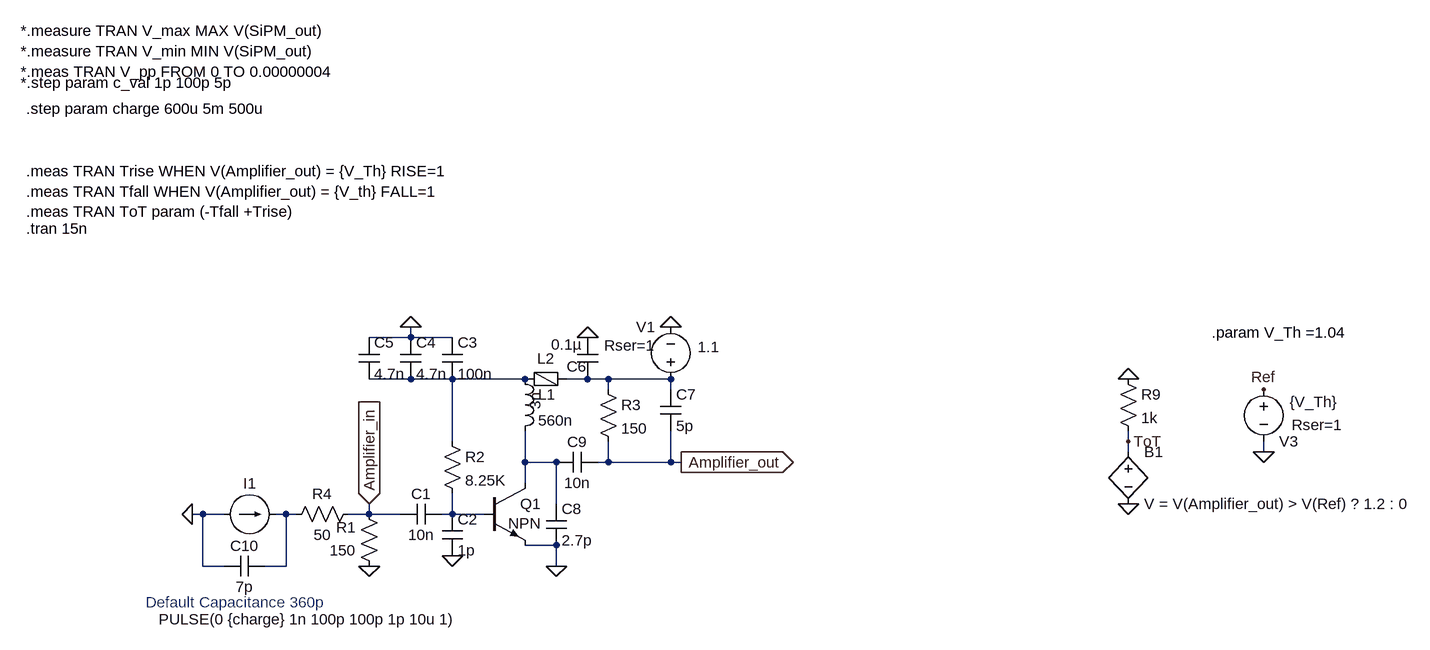
[diagram p0: schematic FARICH_TOT_Simulation_.asc]
FARICH_TOT_Simulation_.asc, the LTspice schematic file:
Version 4
SHEET 1 1708 896
WIRE 128 -112 128 -128
WIRE 128 -112 64 -112
WIRE 192 -112 128 -112
WIRE 128 -48 64 -48
WIRE 192 -48 128 -48
WIRE 304 -48 192 -48
WIRE 400 -48 368 -48
WIRE 432 -48 400 -48
WIRE 528 -48 432 -48
WIRE 432 -32 432 -48
WIRE 528 -32 528 -48
WIRE 192 48 192 -48
WIRE 1232 48 1232 32
WIRE 1232 64 1232 48
WIRE 1440 64 1440 48
WIRE 304 80 304 32
WIRE 352 80 304 80
WIRE 432 80 432 48
WIRE 432 80 416 80
WIRE 528 80 528 32
WIRE 528 80 432 80
WIRE 544 80 528 80
WIRE 304 112 304 80
WIRE 352 144 352 80
WIRE -192 160 -208 160
WIRE -160 160 -192 160
WIRE -64 160 -80 160
WIRE -48 160 -64 160
WIRE 64 160 64 144
WIRE 64 160 32 160
WIRE 112 160 64 160
WIRE 192 160 192 128
WIRE 192 160 176 160
WIRE 240 160 192 160
WIRE 352 208 304 208
WIRE -192 240 -192 160
WIRE -160 240 -192 240
WIRE -64 240 -64 160
WIRE -64 240 -96 240
WIRE 352 240 352 208
FLAG 352 240 0
FLAG 192 224 0
FLAG 64 240 0
FLAG 128 -128 0
FLAG 400 -112 0
FLAG 528 -128 0
FLAG -208 160 0
FLAG 1440 64 0
FLAG 1440 -32 Ref
FLAG 1232 144 0
FLAG 1232 -48 0
FLAG 64 144 Amplifier_in
IOPIN 64 144 In
FLAG 544 80 Amplifier_out
IOPIN 544 80 Out
FLAG 1232 48 ToT
SYMBOL npn3 240 112 R0
WINDOW 3 38 62 Left 2
SYMATTR InstName Q1
SYMBOL res 80 256 R180
WINDOW 0 36 76 Left 2
WINDOW 3 36 40 Left 2
SYMATTR InstName R1
SYMATTR Value 150
SYMBOL cap 176 144 R90
WINDOW 0 0 32 VBottom 2
WINDOW 3 32 32 VTop 2
SYMATTR InstName C1
SYMATTR Value 10n
SYMBOL res 176 32 R0
SYMATTR InstName R2
SYMATTR Value 8.25K
SYMATTR SpiceLine tol=1 pwr=0.1
SYMBOL cap 176 160 R0
SYMATTR InstName C2
SYMATTR Value 1p
SYMATTR SpiceLine V=25 Irms=0 Rser=0.734 Lser=380p mfg="W�rth Elektronik" pn="885012005034 WCAP-CSGP 0402" type="NP0"
SYMBOL cap 176 -112 R0
SYMATTR InstName C3
SYMATTR Value 100n
SYMBOL cap 112 -112 R0
SYMATTR InstName C4
SYMATTR Value 4.7n
SYMBOL cap 48 -112 R0
SYMATTR InstName C5
SYMATTR Value 4.7n
SYMBOL ind 288 -64 R0
SYMATTR InstName L1
SYMATTR Value 560n
SYMATTR SpiceLine Ipk=1.3 Rser=0.095 Rpar=2487.88 Cpar=0
SYMBOL cap 384 -112 R0
WINDOW 0 -16 45 Left 2
WINDOW 3 -40 11 Left 2
SYMATTR InstName C6
SYMATTR Value 0.1µ
SYMATTR SpiceLine V=4 Irms=0 Rser=0 Lser=0 mfg="Murata" pn="GRM022R60G153KE15" type="X5R"
SYMBOL res 416 -48 R0
SYMATTR InstName R3
SYMATTR Value 150
SYMATTR SpiceLine tol=1 pwr=0.1
SYMBOL cap 512 -32 R0
SYMATTR InstName C7
SYMATTR Value 5p
SYMATTR SpiceLine V=25 Irms=0 Rser=0.734 Lser=380p
SYMBOL cap 336 144 R0
SYMATTR InstName C8
SYMATTR Value 2.7p
SYMATTR SpiceLine V=25 Irms=0 Rser=0 Lser=0
SYMBOL cap 416 64 R90
WINDOW 0 0 32 VBottom 2
WINDOW 3 32 32 VTop 2
SYMATTR InstName C9
SYMATTR Value 10n
SYMATTR SpiceLine V=6.3 Irms=25.7m Rser=3.62516 Lser=0
SYMBOL voltage 528 -32 R180
WINDOW 0 24 96 Left 2
WINDOW 3 -75 65 Left 2
WINDOW 123 0 0 Left 0
WINDOW 39 24 68 Left 2
SYMATTR InstName V1
SYMATTR Value 1.1
SYMATTR SpiceLine Rser=1
SYMBOL FerriteBead 336 -48 R90
WINDOW 0 -16 0 VBottom 2
SYMATTR InstName L2
SYMATTR Value 3n
SYMATTR SpiceLine Ipk=2 Rser=0.064 Rpar=620 Cpar=1.1p mfg="W�rth Elektronik" pn="782763621 WE-CBA 1206"
SYMBOL current -160 160 R270
WINDOW 0 32 40 VTop 2
WINDOW 3 -146 131 VBottom 2
WINDOW 123 0 0 Left 0
WINDOW 39 0 0 Left 0
SYMATTR InstName I1
SYMATTR Value PULSE(0 {charge} 1n 100p 100p 1p 10u 1)
SYMBOL res 48 144 R90
WINDOW 0 0 56 VBottom 2
WINDOW 3 32 56 VTop 2
SYMATTR InstName R4
SYMATTR Value 50
SYMBOL cap -96 224 R90
WINDOW 0 0 32 VBottom 2
WINDOW 3 32 32 VTop 2
SYMATTR InstName C10
SYMATTR Value 7p
SYMBOL bv 1232 48 R0
SYMATTR InstName B1
SYMATTR Value V = V(Amplifier_out) > V(Ref) ? 1.2 : 0
SYMBOL voltage 1440 -48 R0
WINDOW 0 24 96 Left 2
WINDOW 3 40 35 Left 2
WINDOW 123 0 0 Left 0
WINDOW 39 43 71 Left 2
SYMATTR InstName V3
SYMATTR Value {V_Th}
SYMATTR SpiceLine Rser=1
SYMBOL res 1216 -64 R0
SYMATTR InstName R9
SYMATTR Value 1k
TEXT -464 -280 Left 2 !.tran 15n
TEXT -280 296 Left 2 ;Default Capacitance 360p
TEXT -472 -584 Left 2 !*.measure TRAN V_max MAX V(SiPM_out)\n*.measure TRAN V_min MIN V(SiPM_out)\n*.meas TRAN V_pp FROM 0 TO 0.00000004
TEXT -472 -504 Left 2 !*.step param c_val 1p 100p 5p
TEXT -464 -464 Left 2 !.step param charge 600u 5m 500u
TEXT -464 -368 Left 2 !.meas TRAN Trise WHEN V(Amplifier_out) = {V_Th} RISE=1\n.meas TRAN Tfall WHEN V(Amplifier_out) = {V_th} FALL=1\n.meas TRAN ToT param (-Tfall +Trise)
TEXT 1360 -120 Left 2 !.param V_Th =1.04

The netlist it stands for:
* FARICH_TOT_Simulation_.asc
Q1 N003 N005 0 0 NPN
R1 0 Amplifier_in 150
C1 N005 Amplifier_in 10n
R2 N001 N005 8.25K tol=1 pwr=0.1
C2 N005 0 1p V=25 Irms=0 Rser=0.734 Lser=380p mfg="W�rth Elektronik" pn="885012005034 WCAP-CSGP 0402" type="NP0"
C3 0 N001 100n
C4 0 N001 4.7n
C5 0 N001 4.7n
L1 N001 N003 560n Ipk=1.3 Rser=0.095 Rpar=2487.88 Cpar=0
C6 0 N002 0.1µ V=4 Irms=0 Rser=0 Lser=0 mfg="Murata" pn="GRM022R60G153KE15" type="X5R"
R3 N002 Amplifier_out 150 tol=1 pwr=0.1
C7 N002 Amplifier_out 5p V=25 Irms=0 Rser=0.734 Lser=380p
C8 N003 0 2.7p V=25 Irms=0 Rser=0 Lser=0
C9 Amplifier_out N003 10n V=6.3 Irms=25.7m Rser=3.62516 Lser=0
V1 N002 0 1.1 Rser=1
L2 N002 N001 3n Ipk=2 Rser=0.064 Rpar=620 Cpar=1.1p mfg="W�rth Elektronik" pn="782763621 WE-CBA 1206"
I1 0 N004 PULSE(0 {charge} 1n 100p 100p 1p 10u 1)
R4 Amplifier_in N004 50
C10 N004 0 7p
B1 ToT 0 V = V(Amplifier_out) > V(Ref) ? 1.2 : 0
V3 Ref 0 {V_Th} Rser=1
R9 0 ToT 1k
.model NPN NPN
.model PNP PNP
.lib standard.bjt
.tran 15n
* Default Capacitance 360p
*.measure TRAN V_max MAX V(SiPM_out)
*.measure TRAN V_min MIN V(SiPM_out)
*.meas TRAN V_pp FROM 0 TO 0.00000004
*.step param c_val 1p 100p 5p
.step param charge 600u 5m 500u
.meas TRAN Trise WHEN V(Amplifier_out) = {V_Th} RISE=1
.meas TRAN Tfall WHEN V(Amplifier_out) = {V_th} FALL=1
.meas TRAN ToT param (-Tfall +Trise)
.param V_Th =1.04
.backanno
.end